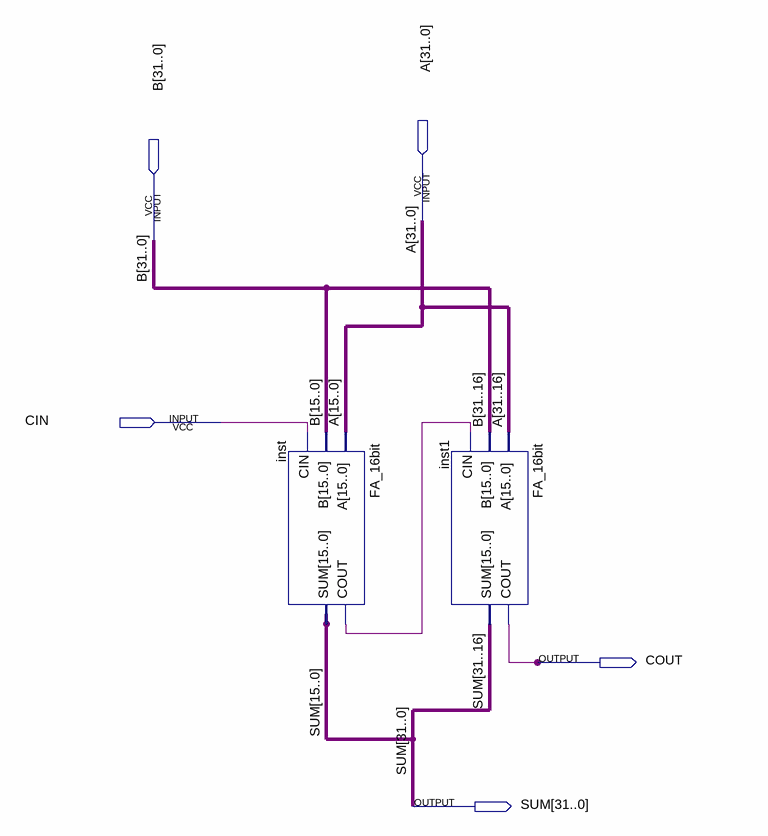
[diagram p0: schematic sheet]
// Quartus schematic FA_32bit.bdf as structural Verilog: 2 symbols, 5 pins
module FA_32bit (
  input  [31:0] A,
  input  [31:0] B,
  input  CIN,
  output COUT,
  output [31:0] SUM
);

  wire inst_cout;

  FA_16bit inst (.A(A[15:0]), .B(B[15:0]), .CIN(CIN), .COUT(inst_cout), .SUM(SUM[15:0]));
  FA_16bit inst1 (.A(A[31:16]), .B(B[31:16]), .CIN(inst_cout), .COUT(COUT), .SUM(SUM[31:16]));
endmodule
